# Altium schematic sheet [06] - STM.SchDoc: MCU+SIM7682
size A3; Date: 25/3/2025; DrawnBy: Le Viet Trong; Revision: V1.1; SheetNumber: 6; SheetTotal: 6
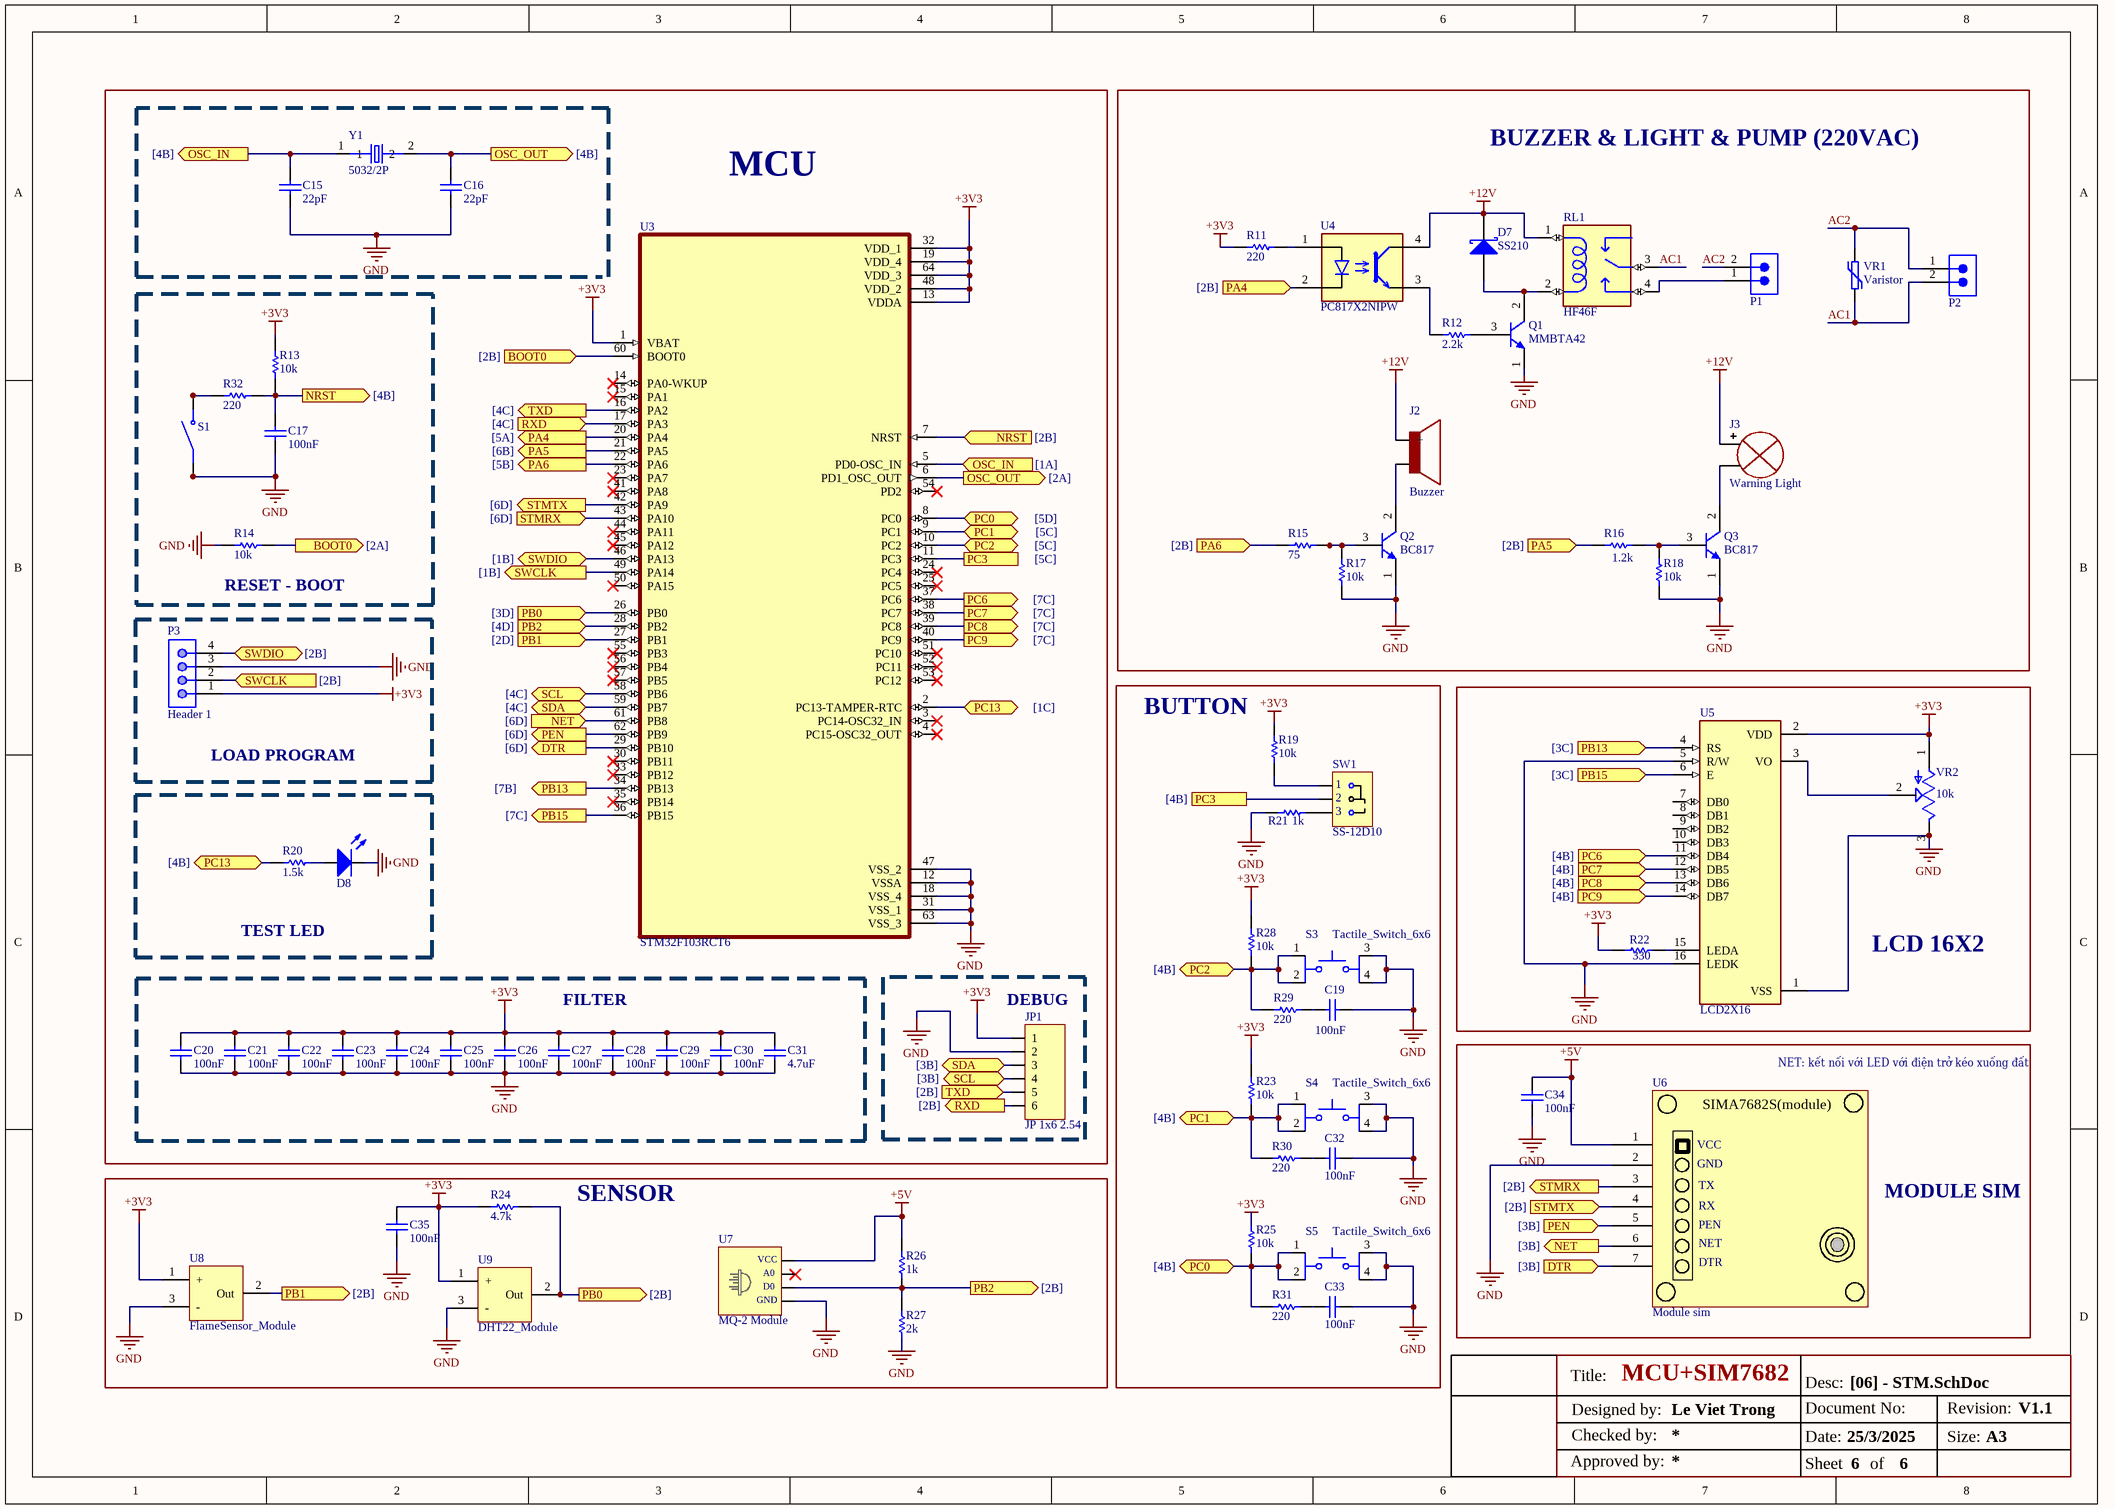
[diagram p0: [06] - STM.SchDoc]

## Parts
C15  22pF  [CAP_0603]
C16  22pF  [CAP_0603]
C17  100nF  [CAP_0603]
C19  100nF  [CAP_0603]
C20  100nF  [CAP_0603]
C21  100nF  [CAP_0603]
C22  100nF  [CAP_0603]
C23  100nF  [CAP_0603]
C24  100nF  [CAP_0603]
C25  100nF  [CAP_0603]
C26  100nF  [CAP_0603]
C27  100nF  [CAP_0603]
C28  100nF  [CAP_0603]
C29  100nF  [CAP_0603]
C30  100nF  [CAP_0603]
C31  4.7uF  [CAP_0603]
C32  100nF  [CAP_0603]
C33  100nF  [CAP_0603]
C34  100nF  [CAP_0603]
C35  100nF  [CAP_0603]
D7  SS210  [SS34]
D8  LED SMD  [LED_0805_Blue]  (value not drawn)
J2  Buzzer  [PHOENIX_1935161]
J3  Warning Light  [PHOENIX_1935161]
JP1  JP 1x6 2.54  [JP 1X6 DT]
P1  691322310002  [691322310002]  (value not drawn)
P2  691322310002  [691322310002]  (value not drawn)
P3  Header 1  [61900411121]
Q1  MMBTA42  [SOT23B]
Q2  BC817  [SOT23B]
Q3  BC817  [SOT23B]
R11  220  [resistor_0603]
R12  2.2k  [resistor_0603]
R13  10k  [resistor_0603]
R14  10k  [resistor_0603]
R15  75  [resistor_0603]
R16  1.2k  [resistor_0603]
R17  10k  [resistor_0603]
R18  10k  [resistor_0603]
R19  10k  [resistor_0603]
R20  1.5k  [resistor_0603]
R21  1k  [resistor_0603]
R22  330  [resistor_0603]
R23  10k  [resistor_0603]
R24  4.7k  [resistor_0603]
R25  10k  [resistor_0603]
R26  1k  [resistor_0603]
R27  2k  [resistor_0603]
R28  10k  [resistor_0603]
R29  220  [resistor_0603]
R30  220  [resistor_0603]
R31  220  [resistor_0603]
R32  220  [resistor_0603]
RL1  HF46F  [HF46F]
S1  Button SMD  [BUTTON]  (value not drawn)
S3  Tactile_Switch_6x6  [Tactile_Switch_6x6]
S4  Tactile_Switch_6x6  [Tactile_Switch_6x6]
S5  Tactile_Switch_6x6  [Tactile_Switch_6x6]
SW1  SS-12D10  [Slide Switch]
U3  STM32F103RCT6  [QFP50P1200X1200X160-64N]
U4  PC817X2NIPW  [PC817XI_SHP]
U5  LCD2X16  [16X2_LCD_NEW]
U6  Module sim  [MODULESIM_NEW]
U7  MQ-2 Module  [JP4-C1T]
U8  FlameSensor_Module  [JP3-C1T]
U9  DHT22_Module  [DHT11_Module]
VR1  Varistor  [07D471K]
VR2  10k  [TRIM_3362P-1-503]
Y1  5032/2P  [OSCCC500X320X135]

## Blocks framed on the sheet
MCU: C15 C16 U3 Y1
BUZZER & LIGHT & PUMP (220VAC): D7 J2 J3 P1 P2 Q1-Q3 R11 R12 R15-R18 RL1 U4 VR1
RESET - BOOT: C17 R13 R14 R32 S1
LOAD PROGRAM: P3
BUTTON: C19 C32 C33 R19 R21 R23 R25 R28-R31 S3-S5 SW1
LCD 16X2: R22 U5 VR2
TEST LED: D8 R20
FILTER: C20-C31
DEBUG: JP1
MODULE SIM: C34 U6
SENSOR: C35 R24 R26 R27 U7-U9

## Ports
BOOT0 (in, see [2B]), BOOT0 (out, see [2A]), DTR (in, see [3B]), DTR (out, see [6D]), NET (in, see [6D]), NET (out, see [3B]), NRST (in, see [2B]), NRST (out, see [4B]), OSC_IN (in, see [1A]), OSC_IN (out, see [4B]), OSC_OUT (out, see [2A]), OSC_OUT (out, see [4B]), PA4 (in, see [2B]), PA4 (out, see [5A]), PA5 (in, see [2B]), PA5 (out, see [6B]), PA6 (in, see [2B]), PA6 (out, see [5B]), PB0 (in, see [3D]), PB0 (out, see [2B]), PB1 (in, see [2D]), PB1 (out, see [2B]), PB2 (in, see [4D]), PB2 (out, see [2B]), PB13 (in, see [3C]), PB13 (out, see [7B]), PB15 (in, see [3C]), PB15 (out, see [7C]), PC0 (bidir, see [4B]), PC0 (bidir, see [5D]), PC1 (bidir, see [4B]), PC1 (bidir, see [5C]), PC2 (bidir, see [4B]), PC2 (bidir, see [5C]), PC3 (see [4B]), PC3 (see [5C]), PC6 (in, see [4B]), PC6 (out, see [7C]), PC7 (in, see [4B]), PC7 (out, see [7C]), PC8 (in, see [4B]), PC8 (out, see [7C]), PC9 (in, see [4B]), PC9 (out, see [7C]), PC13 (bidir, see [1C]), PC13 (bidir, see [4B]), PEN (in, see [3B]), PEN (out, see [6D]), RXD (in, see [4C]), RXD (out, see [2B]), SCL (bidir, see [3B]), SCL (bidir, see [4C]), SDA (bidir, see [3B]), SDA (bidir, see [4C]), STMRX (in, see [6D]), STMRX (out, see [2B]), STMTX (in, see [2B]), STMTX (out, see [6D]), SWCLK (in, see [2B]), SWCLK (out, see [1B]), SWDIO (bidir, see [1B]), SWDIO (bidir, see [2B]), TXD (in, see [2B]), TXD (out, see [4C])

## Nets
+3V3: C20.2 C21.2 C22.2 C23.2 C24.2 C25.1 C26.2 C27.2 C28.2 C29.2 C30.2 C31.2 C35.2 JP1.1 P3.1 R11.1 R13.2 R19.2 R22.2 R23.1 R24.2 R25.1 R28.1 U3.1(VBAT) U3.13(VDDA) U3.19(VDD_4) U3.32(VDD_1) U3.48(VDD_2) U3.64(VDD_3) U5.2(VDD) U8.1(+) U9.1(+) VR2.1(CCW)
+5V: C34.2 R26.1 U6.1(VCC) U7.1
+12V: D7.2(K) J2.1(+) J3.1(+) RL1.1(C1) U4.4
GND: C15.1 C16.1 C17.1 C19.2 C20.1 C21.1 C22.1 C23.1 C24.1 C25.2 C26.1 C27.1 C28.1 C29.1 C30.1 C31.1 C32.2 C33.2 C34.1 C35.1 D8.2(K) JP1.2 P3.3 Q1.1(E) Q2.1(E) Q3.1(E) R14.2 R17.1 R18.1 R21.2 R27.2 S1.1(COM) S1.2(COM) S3.3 S3.4 S4.3 S4.4 S5.3 S5.4 U3.12(VSSA) U3.18(VSS_4) U3.31(VSS_1) U3.47(VSS_2) U3.63(VSS_3) U5.1(VSS) U5.5(R/W) U5.16(LEDK) U6.2(GND) U7.4 U8.3(-) U9.3(-) VR2.3(CW)
AC1: P2.2 RL1.3(C) VR1.2
AC2: P1.2 P2.1 VR1.1
BOOT0: R14.1 U3.60(BOOT0) ; port BOOT0
DTR: U3.29(PB10) U6.7(DTR) ; port DTR
NET: U3.61(PB8) U6.6(NET) ; port NET
NRST: C17.2 R13.1 R32.2 U3.7(NRST) ; port NRST
OSC_IN: C15.2 U3.5(PD0-OSC_IN) Y1.1 ; port OSC_IN
OSC_OUT: C16.2 U3.6(PD1_OSC_OUT) Y1.2 ; port OSC_OUT
PA4: U3.20(PA4) U4.2 ; port PA4
PA5: R16.1 U3.21(PA5) ; port PA5
PA6: R15.2 U3.22(PA6) ; port PA6
PB0: R24.1 U3.26(PB0) U9.2(Out) ; port PB0
PB1: U3.27(PB1) U8.2(Out) ; port PB1
PB2: U3.28(PB2) U7.3 ; port PB2
PB13: U3.34(PB13) U5.4(RS) ; port PB13
PB15: U3.36(PB15) U5.6(E) ; port PB15
PC0: R25.2 R31.1 S5.1 S5.2 U3.8(PC0) ; port PC0
PC1: R23.2 R30.1 S4.1 S4.2 U3.9(PC1) ; port PC1
PC2: R28.2 R29.1 S3.1 S3.2 U3.10(PC2) ; port PC2
PC3: SW1.2 U3.11(PC3) ; port PC3
PC6: U3.37(PC6) U5.11(DB4) ; port PC6
PC7: U3.38(PC7) U5.12(DB5) ; port PC7
PC8: U3.39(PC8) U5.13(DB6) ; port PC8
PC9: U3.40(PC9) U5.14(DB7) ; port PC9
PC13: R20.2 U3.2(PC13-TAMPER-RTC) ; port PC13
PEN: U3.62(PB9) U6.5(PEN) ; port PEN
RXD: JP1.6 U3.17(PA3) ; port RXD
SCL: JP1.4 U3.58(PB6) ; port SCL
SDA: JP1.3 U3.59(PB7) ; port SDA
STMRX: U3.43(PA10) U6.3(TX) ; port STMRX
STMTX: U3.42(PA9) U6.4(RX) ; port STMTX
SWCLK: P3.2 U3.49(PA14) ; port SWCLK
SWDIO: P3.4 U3.46(PA13) ; port SWDIO
TXD: JP1.5 U3.16(PA2) ; port TXD
NetC19_1: C19.1 R29.2
NetC32_1: C32.1 R30.2
NetC33_1: C33.1 R31.2
NetD7_1: D7.1(A) Q1.2(C) RL1.2(C2)
NetD8_1: D8.1(A) R20.1
NetJ2_2: J2.2(-) Q2.2(C)
NetJ3_2: J3.2(-) Q3.2(C)
NetP1_1: P1.1 RL1.4(NO)
NetQ1_3: Q1.3(B) R12.2
NetQ2_3: Q2.3(B) R15.1 R17.2
NetQ3_3: Q3.3(B) R16.2 R18.2
NetR11_2: R11.2 U4.1
NetR12_1: R12.1 U4.3
NetR19_1: R19.1 SW1.1
NetR21_1: R21.1 SW1.3
NetR22_1: R22.1 U5.15(LEDA)
NetR26_2: R26.2 R27.1
NetR32_1: R32.1 S1.3(NO) S1.4(NO)
NetU5_3: U5.3(VO) VR2.2(WIPER)

Not connected (* = marked no-connect by the designer): U3 3(PC14-OSC32_IN)* 4(PC15-OSC32_OUT)* 14(PA0-WKUP)* 15(PA1)* 23(PA7)* 24(PC4)* 25(PC5)* 30(PB11)* 33(PB12)* 35(PB14)* 41(PA8)* 44(PA11)* 45(PA12)* 50(PA15)* 51(PC10)* 52(PC11)* 53(PC12)* 54(PD2)* 55(PB3)* 56(PB4)* 57(PB5)*; U5 7(DB0) 8(DB1) 9(DB2) 10(DB3); U7 2*

## Notes on the sheet
- NET: kết nối với LED với điện trở kéo xuống đất
- Title:
- Desc:
- Designed by:
- Checked by:
- Date:
- Document No:
- Revision:
- Size:
- A3
- Approved by:
- Sheet
- of
- (in symbol Module_A7682S_V2) SIMA7682S(module)
- (in symbol MQ-2 Module) VCC; A0; D0; GND

## Library data of the parts
C15 C16 = 01060322010: CAP, size 0603, 22pF; Supply 2 name: Thegioiic; Capacitance Tolerance: +/-10%; ComponentLink1Description: Manufacturer; ComponentLink1URL: Thegioiic; ComponentLink2Description: Datasheet; ComponentLink2URL: *; Operating Temperature: -55 to +125degC; Packaging: Tape and Reel; Supply 1 SN: *; Supply 1 name: *; Supply 1 URL: *; Supply 2 SN: *; Supply 2 URL: https://www.thegioiic.com/tu-gom-0603-22pf-50v; *: *; Height: *; Mounting Technology: SMT; Size: 0603; Capacitance: 22pF; Technical Reference: *
C17 C19-C30 C32-C35 = 01060310410: CAP, size 0603, 100nF; Supply 1 SN: 885012206095; Supply 1 name: Wurth Elektronik; Supply 2 name: Thegioiic; Capacitance Tolerance: +/-10%; ComponentLink1Description: Manufacturer; ComponentLink1URL: http://www.we-online.de; ComponentLink2Description: Datasheet; ComponentLink2URL: https://www.we-online.com/catalog/datasheet/885012206095.pdf; Operating Temperature: -55 to +125degC; Packaging: Tape and Reel; Supply 1 URL: https://www.we-online.com/en/components/products/WCAP-CSGP-50VDC?sq=885012206095R#885012206095R; Supply 2 SN: *; Supply 2 URL: https://www.thegioiic.com/tu-gom-0603-100nf-0-1uf-50v; Dissipation Factor: *; Height: *; Mounting Technology: SMT; Size: 0603; Capacitance: 100nF; Technical Reference: *
C31 = 01060310510: CAP, size 0603, 1uF; Supply 1 SN: 885012206126; Supply 1 name: Wurth Elektronik; Supply 2 name: Thegioiic; Capacitance Tolerance: +/-10%; ComponentLink1Description: Manufacturer; ComponentLink1URL: http://www.we-online.de; ComponentLink2Description: Datasheet; ComponentLink2URL: https://www.we-online.com/components/products/datasheet/885012206126.pdf; Operating Temperature: -55 to +125degC; Packaging: Tape and Reel; Supply 1 URL: https://www.we-online.com/en/components/products/WCAP-CSGP-50VDC?sq=885012206126#885012206126; Supply 2 SN: *; Supply 2 URL: https://www.thegioiic.com/tu-gom-0603-1uf-50v; Dissipation Factor: *; Height: *; Mounting Technology: SMT; Size: 0603; Capacitance: 1uF; Technical Reference: *
D7 = D Schottky: Schottky Diode; Published: 8-Jun-2000; LatestRevisionDate: 17-Jul-2002; LatestRevisionNote: Re-released for DXP Platform.; PackageReference: SMB; Publisher: Altium Limited; PackageDescription: DO-214-AA/SMB; 2 C-Bend Leads; Body 5.3 x 3.6 mm, inc. leads (LxW); Code_JEDEC: DO-214-AA
D8 = LED SMD: LED
J2 = Buzzer_12v
J3 = Light_12V
JP1 = JP 1x6 2.54 Duc: Cắm; Ten_Linh_Kien: Jump Đơn Đực 2.54MM 1x40P Cong Đứng; Don_Vi: Con; Ma_Hang: MH000904; Ghi_Chu: *; Kieu_Chan: *; Chung_Loai: Cắm
P1 P2 = 691322310002: WR-TBL Series 322 Horizontal PCB Header, THT, pitch 3.81mm, 2p; Manufacturer: Wurth Elektronik; Modularity: No; Rated Current: 10A; Working Voltage: 300V; Supply 3 Name: ThegioiIC; ComponentLink1Description: Website Link; ComponentLink1URL: https://www.we-online.com/redexpert/article/691322310002?ad; ComponentLink2Description: Datasheet Link; ComponentLink2URL: https://www.we-online.com/redexpert/spec/691322310002?ad; Manufacturer Part Number: 691322310002; Category: Terminal Blocks; Match Code: WR-TBL; Mount: Through Hole; Operating Temperature Max: 105°C; Operating Temperature Min: -40°C; Packaging: Box; Application: Pluggable; Number of Pins: 2; Number of Rows: 1; Orientation: Horizontal; Pitch: 3.81mm; Supply 1 Name: *; Supply 1 SN: *; Supply 1 URL: *; Supply 2 Name: *; Supply 2 SN: *; Supply 2 URL: *; Supply 3 SN: *; Supply 3 URL 1: https://www.thegioiic.com/kf-3-81-2-r-terminal-block-plug-in-han-pcb-2-chan-cong-3-81mm-300v-10a; Supply 3 URL 2: https://www.thegioiic.com/ul-3-81-2-r-terminal-block-plug-in-han-pcb-2-chan-cong-3-81mm-300v-10a-ulo
P3 = 61900411121: WR-WTB THT Male Vertical Locking Header, pitch 2.54mm, 4p; Pin Number: 4; Contact Resistance: 20mOhm; Rated Current: 3A; Withstanding Voltage: 1000VAC; Working Voltage: 250VAC; ComponentLink1Description: Manufacturer; ComponentLink1URL: http://www.we-online.de; ComponentLink2Description: Datasheet; ComponentLink2URL: https://www.we-online.com/catalog/datasheet/61900411121.pdf; Pitch: 2.54mm; Published Date: January 2020; Publisher: Wurth Elektronik; Mounting Technology: THT; Packaging: Bag; Operating Temperature: -40 to +105degC; Part Number: 61900411121; Gender: Male; Type: Vertical
Q1-Q3 = BC817: NPN Bipolar Transistor
R11 = 0006032211: RES, 220 Ohm, size 0603, 1%; Resistance Tolerant: +/-1%; Rated Power: 1/4W; Supply 1 Name: Mouser; Supply 1 SN: 667-ERJ-UP3F2200V; Supply 2 Name: Digikey; Supply 2 SN: 10-ERJ-UP3F2200VTR-ND 10-ERJ-UP3F2200VCT-ND 10-ERJ-UP3F2200VDKR-ND; Resistance: 220; Size: 0603; Mounting Technology: SMT; ComponentLink1Description: Datasheet link; ComponentLink1URL: https://api.pim.na.industrial.panasonic.com/file_stream/main/fileversion/4484; ComponentLink2Description: Supply 1 URL; ComponentLink2URL: https://www.mouser.vn/ProductDetail/Panasonic/ERJ-UP3F2200V?qs=sGAEpiMZZMvdGkrng054twq3eZrCFN89E%252BhCXuCu3h8RslmTO1I28Q%3D%3D; ComponentLink3Description: Supply 2 URL; ComponentLink3URL: https://www.digikey.com/en/products/detail/panasonic-electronic-components/ERJ-UP3F2200V/12092129
R12 = 0006032221: RES, 2.2k Ohm, size 0603, 1%; Resistance Tolerant: +/-1%; Rated Power: 1/4W; Supply 1 Name: Mouser; Supply 1 SN: 667-ERJ-UP3F2201V; Supply 2 Name: Digikey; Supply 2 SN: 10-ERJ-UP3F2201VTR-ND 10-ERJ-UP3F2201VCT-ND 10-ERJ-UP3F2201VDKR-ND; Supply 3 Name: thegioiic; Supply 3 SN: NA; Resistance: 2.2k; Size: 0603; Mounting Technology: SMT; ComponentLink1Description: Datasheet link; ComponentLink1URL: https://api.pim.na.industrial.panasonic.com/file_stream/main/fileversion/4484; ComponentLink2Description: Supply 1 URL; ComponentLink2URL: https://www.mouser.vn/ProductDetail/Panasonic/ERJ-UP3F2201V?qs=sGAEpiMZZMvdGkrng054twq3eZrCFN89KeaXYJ5LTWyJgfuuVVfZrw%3D%3D; ComponentLink3Description: Supply 2 URL; ComponentLink3URL: https://www.digikey.com/en/products/detail/panasonic-electronic-components/ERJ-UP3F2201V/12092708; ComponentLink4Description: Supply 3 URL; ComponentLink4URL: https://www.thegioiic.com/dien-tro-2-2-kohm-0603-1
R13 R14 R19 R23 R25 R28 = 0006031031: RES, 10k Ohm, size 0603, 1%; Resistance Tolerant: +/-1%; Rated Power: 1/4W; Supply 1 Name: Mouser; Supply 1 SN: 755-ESR03EZPF1002; Supply 2 Name: Digikey; Supply 2 SN: RHM10KADTR-ND RHM10KADCT-ND RHM10KADDKR-ND; Resistance: 10k; Size: 0603; Mounting Technology: SMT; ComponentLink1Description: Datasheet link; ComponentLink1URL: https://fscdn.rohm.com/en/products/databook/datasheet/passive/resistor/chip_resistor/esr-e.pdf; ComponentLink2Description: Supply 1 URL; ComponentLink2URL: https://www.mouser.vn/ProductDetail/ROHM-Semiconductor/ESR03EZPF1002?qs=sGAEpiMZZMvdGkrng054t67Efho1F8r6CDeAsqwFse8%3D; ComponentLink3Description: Supply 2 URL; ComponentLink3URL: https://www.digikey.com/en/products/detail/rohm-semiconductor/ESR03EZPF1002/1983429
R15 = 0006032221: RES, 75 Ohm, size 0603, 1%; Resistance: 2.2k; Resistance Tolerant: +/-1%; Rated Power: 1/4W; Supply 1 Name: Mouser; Supply 1 SN: 667-ERJ-UP3F2201V; Supply 2 Name: Digikey; Supply 2 SN: 10-ERJ-UP3F2201VTR-ND 10-ERJ-UP3F2201VCT-ND 10-ERJ-UP3F2201VDKR-ND; Supply 3 Name: thegioiic; Supply 3 SN: NA; Size: 0603; Mounting Technology: SMT; ComponentLink1Description: Datasheet link; ComponentLink1URL: https://api.pim.na.industrial.panasonic.com/file_stream/main/fileversion/4484; ComponentLink2Description: Supply 1 URL; ComponentLink2URL: https://www.mouser.vn/ProductDetail/Panasonic/ERJ-UP3F2201V?qs=sGAEpiMZZMvdGkrng054twq3eZrCFN89KeaXYJ5LTWyJgfuuVVfZrw%3D%3D; ComponentLink3Description: Supply 2 URL; ComponentLink3URL: https://www.digikey.com/en/products/detail/panasonic-electronic-components/ERJ-UP3F2201V/12092708; ComponentLink4Description: Supply 3 URL; ComponentLink4URL: https://www.thegioiic.com/dien-tro-2-2-kohm-0603-1
R16 = 0006032221: RES, 1.2k Ohm, size 0603, 1%; Resistance: 2.2k; Resistance Tolerant: +/-1%; Rated Power: 1/4W; Supply 1 Name: Mouser; Supply 1 SN: 667-ERJ-UP3F2201V; Supply 2 Name: Digikey; Supply 2 SN: 10-ERJ-UP3F2201VTR-ND 10-ERJ-UP3F2201VCT-ND 10-ERJ-UP3F2201VDKR-ND; Supply 3 Name: thegioiic; Supply 3 SN: NA; Size: 0603; Mounting Technology: SMT; ComponentLink1Description: Datasheet link; ComponentLink1URL: https://api.pim.na.industrial.panasonic.com/file_stream/main/fileversion/4484; ComponentLink2Description: Supply 1 URL; ComponentLink2URL: https://www.mouser.vn/ProductDetail/Panasonic/ERJ-UP3F2201V?qs=sGAEpiMZZMvdGkrng054twq3eZrCFN89KeaXYJ5LTWyJgfuuVVfZrw%3D%3D; ComponentLink3Description: Supply 2 URL; ComponentLink3URL: https://www.digikey.com/en/products/detail/panasonic-electronic-components/ERJ-UP3F2201V/12092708; ComponentLink4Description: Supply 3 URL; ComponentLink4URL: https://www.thegioiic.com/dien-tro-2-2-kohm-0603-1
R17 R18 = 0006032221: RES, 10k Ohm, size 0603, 1%; Resistance: 2.2k; Resistance Tolerant: +/-1%; Rated Power: 1/4W; Supply 1 Name: Mouser; Supply 1 SN: 667-ERJ-UP3F2201V; Supply 2 Name: Digikey; Supply 2 SN: 10-ERJ-UP3F2201VTR-ND 10-ERJ-UP3F2201VCT-ND 10-ERJ-UP3F2201VDKR-ND; Supply 3 Name: thegioiic; Supply 3 SN: NA; Size: 0603; Mounting Technology: SMT; ComponentLink1Description: Datasheet link; ComponentLink1URL: https://api.pim.na.industrial.panasonic.com/file_stream/main/fileversion/4484; ComponentLink2Description: Supply 1 URL; ComponentLink2URL: https://www.mouser.vn/ProductDetail/Panasonic/ERJ-UP3F2201V?qs=sGAEpiMZZMvdGkrng054twq3eZrCFN89KeaXYJ5LTWyJgfuuVVfZrw%3D%3D; ComponentLink3Description: Supply 2 URL; ComponentLink3URL: https://www.digikey.com/en/products/detail/panasonic-electronic-components/ERJ-UP3F2201V/12092708; ComponentLink4Description: Supply 3 URL; ComponentLink4URL: https://www.thegioiic.com/dien-tro-2-2-kohm-0603-1
R20 = 0006031521: RES, 1.5 kOhms, size 0603, 1%; Resistance tolerance: +/-1%; Rated Power: 1/4 W; Supply 1 Name: Mouser; Supply 1 SN: 755-SFR03EZPF1501; Supply 2 Name: Digi-Key; Supply 2 SN: 13-RC0603FR-071R5LTR-ND; Size: 0603; Mounting Technology: SMT; Resistance: 1.5 k; ComponentLink1Description: Datasheet link; ComponentLink1URL: *; Supply 1 URL: https://www.mouser.vn/ProductDetail/ROHM-Semiconductor/SFR03EZPF1501?qs=byeeYqUIh0NryWvnzlukLQ%3D%3D; Supply 2 URL: https://www.digikey.com/en/products/detail/yageo/RC0603FR-071R5L/5918292; Supply 3 Name: *; Supply 3 SN: *
R21 R26 = 0006031031: RES, 1k Ohm, size 0603, 1%; Resistance: 10k; Resistance Tolerant: +/-1%; Rated Power: 1/4W; Supply 1 Name: Mouser; Supply 1 SN: 755-ESR03EZPF1002; Supply 2 Name: Digikey; Supply 2 SN: RHM10KADTR-ND RHM10KADCT-ND RHM10KADDKR-ND; Size: 0603; Mounting Technology: SMT; ComponentLink1Description: Datasheet link; ComponentLink1URL: https://fscdn.rohm.com/en/products/databook/datasheet/passive/resistor/chip_resistor/esr-e.pdf; ComponentLink2Description: Supply 1 URL; ComponentLink2URL: https://www.mouser.vn/ProductDetail/ROHM-Semiconductor/ESR03EZPF1002?qs=sGAEpiMZZMvdGkrng054t67Efho1F8r6CDeAsqwFse8%3D; ComponentLink3Description: Supply 2 URL; ComponentLink3URL: https://www.digikey.com/en/products/detail/rohm-semiconductor/ESR03EZPF1002/1983429
R22 = 0006032221: RES, 330 Ohm, size 0603, 1%; Resistance: 2.2k; Resistance Tolerant: +/-1%; Rated Power: 1/4W; Supply 1 Name: Mouser; Supply 1 SN: 667-ERJ-UP3F2201V; Supply 2 Name: Digikey; Supply 2 SN: 10-ERJ-UP3F2201VTR-ND 10-ERJ-UP3F2201VCT-ND 10-ERJ-UP3F2201VDKR-ND; Supply 3 Name: thegioiic; Supply 3 SN: NA; Size: 0603; Mounting Technology: SMT; ComponentLink1Description: Datasheet link; ComponentLink1URL: https://api.pim.na.industrial.panasonic.com/file_stream/main/fileversion/4484; ComponentLink2Description: Supply 1 URL; ComponentLink2URL: https://www.mouser.vn/ProductDetail/Panasonic/ERJ-UP3F2201V?qs=sGAEpiMZZMvdGkrng054twq3eZrCFN89KeaXYJ5LTWyJgfuuVVfZrw%3D%3D; ComponentLink3Description: Supply 2 URL; ComponentLink3URL: https://www.digikey.com/en/products/detail/panasonic-electronic-components/ERJ-UP3F2201V/12092708; ComponentLink4Description: Supply 3 URL; ComponentLink4URL: https://www.thegioiic.com/dien-tro-2-2-kohm-0603-1
R24 = 0006031031: RES, 4.7k Ohm, size 0603, 1%; Resistance: 10k; Resistance Tolerant: +/-1%; Rated Power: 1/4W; Supply 1 Name: Mouser; Supply 1 SN: 755-ESR03EZPF1002; Supply 2 Name: Digikey; Supply 2 SN: RHM10KADTR-ND RHM10KADCT-ND RHM10KADDKR-ND; Size: 0603; Mounting Technology: SMT; ComponentLink1Description: Datasheet link; ComponentLink1URL: https://fscdn.rohm.com/en/products/databook/datasheet/passive/resistor/chip_resistor/esr-e.pdf; ComponentLink2Description: Supply 1 URL; ComponentLink2URL: https://www.mouser.vn/ProductDetail/ROHM-Semiconductor/ESR03EZPF1002?qs=sGAEpiMZZMvdGkrng054t67Efho1F8r6CDeAsqwFse8%3D; ComponentLink3Description: Supply 2 URL; ComponentLink3URL: https://www.digikey.com/en/products/detail/rohm-semiconductor/ESR03EZPF1002/1983429
R27 = 0006031031: RES, 2k Ohm, size 0603, 1%; Resistance: 10k; Resistance Tolerant: +/-1%; Rated Power: 1/4W; Supply 1 Name: Mouser; Supply 1 SN: 755-ESR03EZPF1002; Supply 2 Name: Digikey; Supply 2 SN: RHM10KADTR-ND RHM10KADCT-ND RHM10KADDKR-ND; Size: 0603; Mounting Technology: SMT; ComponentLink1Description: Datasheet link; ComponentLink1URL: https://fscdn.rohm.com/en/products/databook/datasheet/passive/resistor/chip_resistor/esr-e.pdf; ComponentLink2Description: Supply 1 URL; ComponentLink2URL: https://www.mouser.vn/ProductDetail/ROHM-Semiconductor/ESR03EZPF1002?qs=sGAEpiMZZMvdGkrng054t67Efho1F8r6CDeAsqwFse8%3D; ComponentLink3Description: Supply 2 URL; ComponentLink3URL: https://www.digikey.com/en/products/detail/rohm-semiconductor/ESR03EZPF1002/1983429
R29-R32 = 0006031031: RES, 220 Ohm, size 0603, 1%; Resistance: 10k; Resistance Tolerant: +/-1%; Rated Power: 1/4W; Supply 1 Name: Mouser; Supply 1 SN: 755-ESR03EZPF1002; Supply 2 Name: Digikey; Supply 2 SN: RHM10KADTR-ND RHM10KADCT-ND RHM10KADDKR-ND; Size: 0603; Mounting Technology: SMT; ComponentLink1Description: Datasheet link; ComponentLink1URL: https://fscdn.rohm.com/en/products/databook/datasheet/passive/resistor/chip_resistor/esr-e.pdf; ComponentLink2Description: Supply 1 URL; ComponentLink2URL: https://www.mouser.vn/ProductDetail/ROHM-Semiconductor/ESR03EZPF1002?qs=sGAEpiMZZMvdGkrng054t67Efho1F8r6CDeAsqwFse8%3D; ComponentLink3Description: Supply 2 URL; ComponentLink3URL: https://www.digikey.com/en/products/detail/rohm-semiconductor/ESR03EZPF1002/1983429
RL1 = HF46F: SeriesHF46F 12V 1 Form A 1A Gold Plated SUBMINIATURE INTERMEDIATE POWER RELAY; MF: Hongfa; Package: None; Price: None; Value: *; SnapEDA_Link: https://www.snapeda.com/parts/HF46F/Hongfa/view-part/?ref=snap; MP: HF46F; Availability: Not in stock; Check_prices: https://www.snapeda.com/parts/HF46F/Hongfa/view-part/?ref=eda
S1 = Button SMD: Nút Nhấn 4x4mm Cao 1.5mm 4 Chân SMD Chống Nước; MP: 8-1437565-1; Package: None; Price: None; Availability: Unavailable; Value: *
S3-S5 = Tactile_Switch_6x6: Tactile Switch, 6x6mm
SW1 = SS-12D10: SS-12D10 Công Tắc Trượt 3 Chân Xuyên Lỗ ON-OFF 1P2T 0.5A
U3 = STM32F103RCT6: ARMÂ® CortexÂ®-M3 STM32F1 Microcontroller IC 32-Bit 72MHz 256KB (256K x 8) FLASH 64-LQFP (10x10); MF: STMicroelectronics; Value: *; SnapEDA_Link: https://www.snapeda.com/parts/STM32F103RCT6/STMicroelectronics/view-part/?ref=snap; MP: STM32F103RCT6; Purchase-URL: https://pricing.snapeda.com/search/part/STM32F103RCT6/?ref=eda; Check_prices: https://www.snapeda.com/parts/STM32F103RCT6/STMicroelectronics/view-part/?ref=eda; Availability: In Stock; Price: None; Package: LQFP-64 STMicroelectronics
U4 = PC817X2NIPW: PC817 series, SMD, I_F (max) = 500mA, V_F (max) = 1.4V. / Breakdown voltage: BV_CE = 80V, BV_BE = 6V.
U5 = LCD2X16: Display; Display: LCD 2x16 characters (blue backlight); MF: mikroElektronika; SnapEDA_Link: https://www.snapeda.com/parts/LCD%202X16/mikroElektronika/view-part/?ref=snap; Package: TQFP-64 mikroElektronika; Value: *; MP: LCD 2X16; Check_prices: https://www.snapeda.com/parts/LCD%202X16/mikroElektronika/view-part/?ref=eda
U6 = Module_A7682S_V2: Module 4G A7682S Volte Ra chân V2 TDM2431, 4.5-16V, 28×26.8×5.5mm, Mức logic I/OTTL( Serial 3.3V)
U7 = MQ-2 Module: Nguồn: 5VDC, Dòng: 150mA, đầu ra: digital analog.
U8 = FlameSensor_Module: LM393, 3 Chân, Nguồn: 3.3-5VDC, góc quét 60 độ, ngõ ra Digital, 32x14mm
U9 = DHT11_Module: Temperature & Humidity Sensor, 3.3V-5V, 5mA
VR1 = 07D471K 470V
VR2 = 3362P-1-503: 10 kOhms 0.5W, 1/2W PC Pins Through Hole Trimmer Potentiometer Cermet 1 Turn Top Finger Adjustment; MF: Bourns; Purchase-URL: https://pricing.snapeda.com/search/part/3362P-1-503/?ref=eda; Check_prices: https://www.snapeda.com/parts/3362P-1-503/Bourns/view-part/1483011/?ref=eda; SnapEDA_Link: https://www.snapeda.com/parts/3362P-1-503/Bourns/view-part/1483011/?ref=snap; Package: 3116 Bourns; MP: 3362P-1-503; Value: *; Availability: Warning; Price: None
Y1 = 5032/2P: SMD Crystal 12Mhz-20pF-20ppm-40R;; MF: Xinhunjing; Package: None; Value: *; Price: None; MP: 5032/2P; Availability: Unavailable; SnapEDA_Link: https://www.snapeda.com/parts/5032/2P/Xinhunjing/view-part/105659/?ref=snap